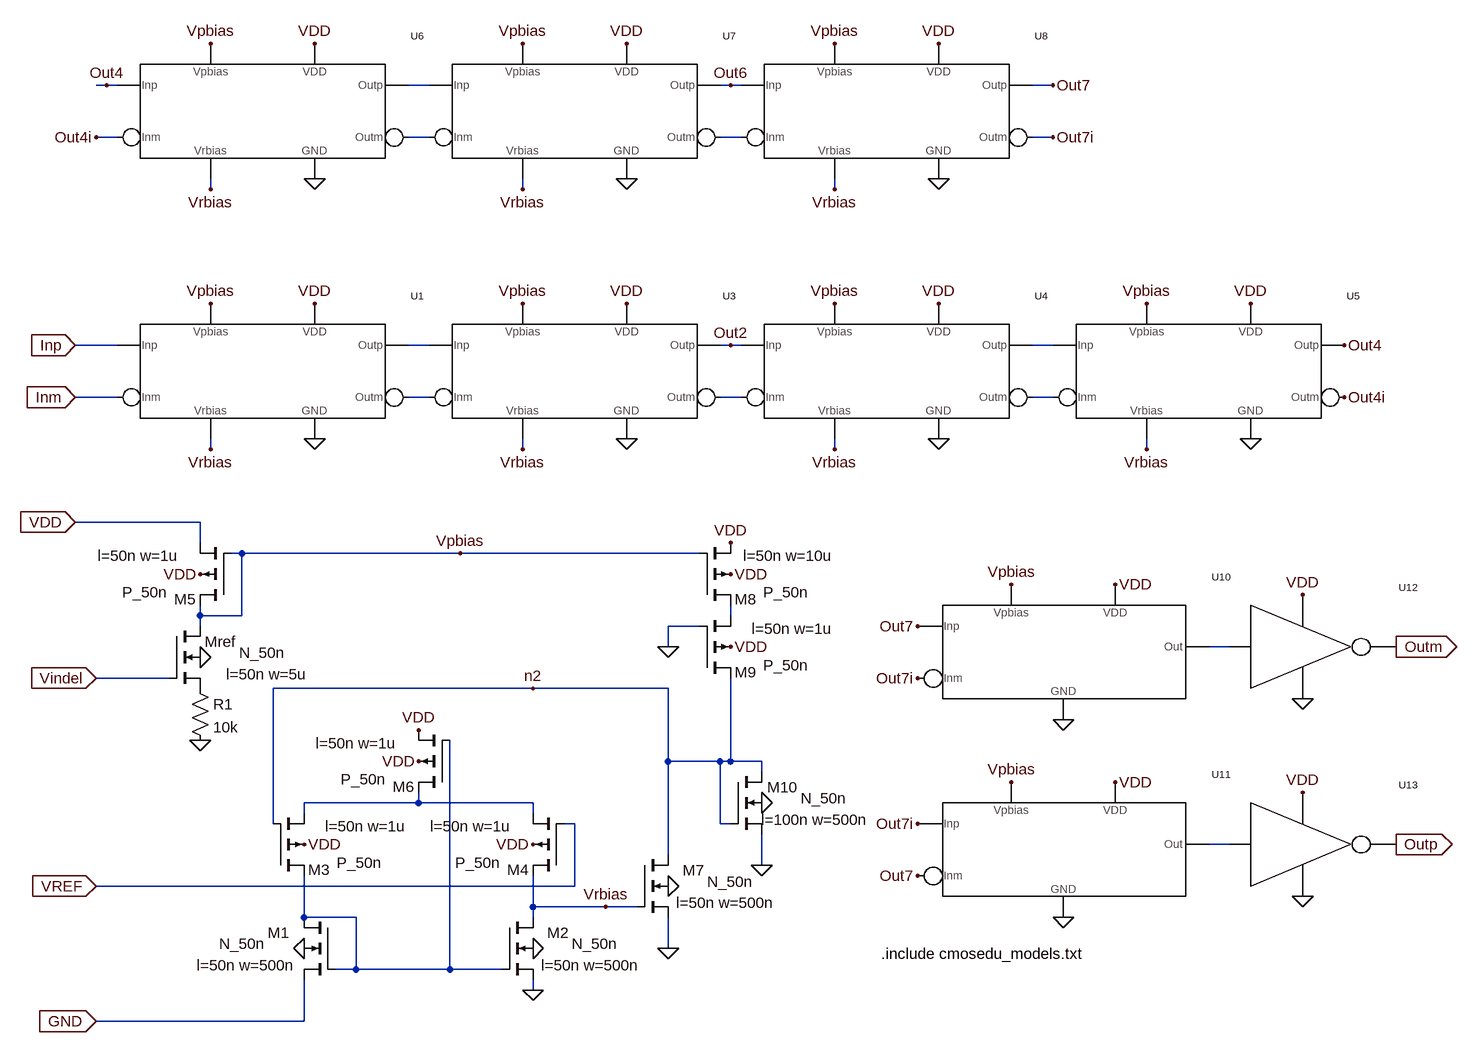
[diagram p0: schematic Fig_19_63.asc]
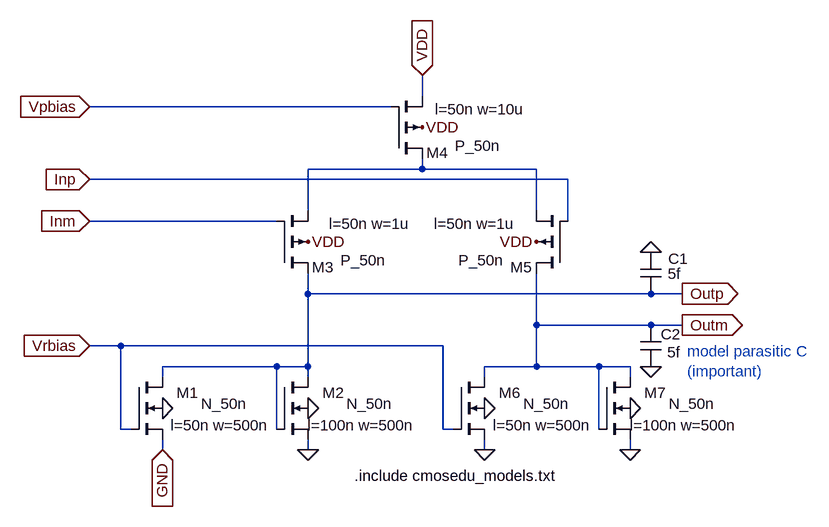
[diagram p1: sub-circuit delay.asc]
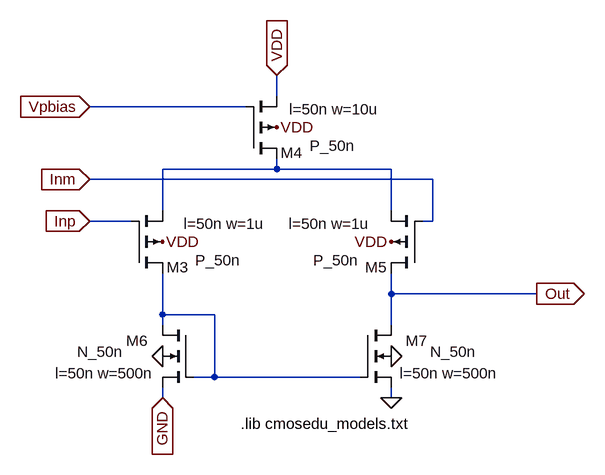
[diagram p2: sub-circuit pdiff.asc]
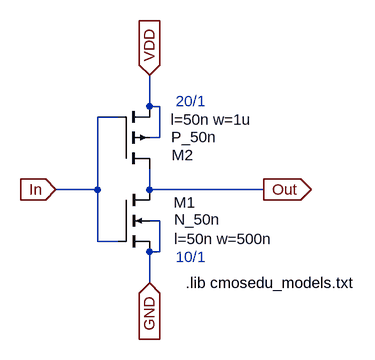
[diagram p3: sub-circuit inv_20_10.asc]
Fig_19_63.asc, the LTspice schematic file:
Version 4
SHEET 1 4588 680
WIRE 656 -1792 640 -1792
WIRE 672 -1792 656 -1792
WIRE 1152 -1792 1120 -1792
WIRE 1616 -1792 1600 -1792
WIRE 1632 -1792 1616 -1792
WIRE 2112 -1792 2080 -1792
WIRE 672 -1712 640 -1712
WIRE 1152 -1712 1120 -1712
WIRE 1632 -1712 1600 -1712
WIRE 2112 -1712 2080 -1712
WIRE 816 -1632 816 -1648
WIRE 1296 -1632 1296 -1648
WIRE 1776 -1632 1776 -1648
WIRE 672 -1392 608 -1392
WIRE 1152 -1392 1120 -1392
WIRE 1616 -1392 1600 -1392
WIRE 1632 -1392 1616 -1392
WIRE 2112 -1392 2080 -1392
WIRE 672 -1312 608 -1312
WIRE 1152 -1312 1120 -1312
WIRE 1632 -1312 1600 -1312
WIRE 2112 -1312 2080 -1312
WIRE 816 -1232 816 -1248
WIRE 1296 -1232 1296 -1248
WIRE 1776 -1232 1776 -1248
WIRE 2256 -1232 2256 -1248
WIRE 800 -1120 608 -1120
WIRE 800 -1088 800 -1120
WIRE 864 -1072 848 -1072
WIRE 1200 -1072 864 -1072
WIRE 1568 -1072 1200 -1072
WIRE 800 -976 800 -992
WIRE 864 -976 864 -1072
WIRE 864 -976 800 -976
WIRE 1616 -976 1616 -992
WIRE 800 -960 800 -976
WIRE 1568 -960 1520 -960
WIRE 1520 -928 1520 -960
WIRE 2384 -928 2352 -928
WIRE 752 -880 640 -880
WIRE 1312 -864 912 -864
WIRE 1520 -864 1312 -864
WIRE 1520 -752 1520 -864
WIRE 1600 -752 1520 -752
WIRE 1616 -752 1616 -880
WIRE 1616 -752 1600 -752
WIRE 1664 -752 1616 -752
WIRE 1664 -736 1664 -752
WIRE 1136 -688 1136 -704
WIRE 1136 -688 960 -688
WIRE 1312 -688 1136 -688
WIRE 960 -672 960 -688
WIRE 1312 -672 1312 -688
WIRE 912 -656 912 -864
WIRE 1376 -656 1360 -656
WIRE 1600 -656 1600 -752
WIRE 1616 -656 1600 -656
WIRE 2384 -624 2352 -624
WIRE 1520 -608 1520 -752
WIRE 1664 -592 1664 -640
WIRE 1376 -560 1376 -656
WIRE 1376 -560 640 -560
WIRE 1312 -528 1312 -576
WIRE 1424 -528 1312 -528
WIRE 1472 -528 1424 -528
WIRE 960 -512 960 -576
WIRE 1040 -512 960 -512
WIRE 1312 -512 1312 -528
WIRE 1520 -464 1520 -512
WIRE 1040 -432 1040 -512
WIRE 1040 -432 1008 -432
WIRE 1184 -432 1184 -784
WIRE 1184 -432 1040 -432
WIRE 1264 -432 1184 -432
WIRE 1312 -400 1312 -416
WIRE 960 -352 960 -416
WIRE 960 -352 640 -352
FLAG 960 -464 0
FLAG 960 -624 VDD
FLAG 1312 -624 VDD
FLAG 1312 -464 0
FLAG 800 -1040 VDD
FLAG 1520 -560 0
FLAG 1520 -464 0
FLAG 1136 -752 VDD
FLAG 1136 -800 VDD
FLAG 1312 -400 0
FLAG 800 -912 0
FLAG 800 -784 0
FLAG 1616 -1040 VDD
FLAG 1616 -1088 VDD
FLAG 1616 -928 VDD
FLAG 1520 -928 0
FLAG 1664 -688 0
FLAG 1664 -592 0
FLAG 1424 -528 Vrbias
FLAG 1312 -864 n2
FLAG 1200 -1072 Vpbias
FLAG 976 -1456 VDD
FLAG 976 -1248 0
FLAG 816 -1456 Vpbias
FLAG 816 -1232 Vrbias
FLAG 1456 -1456 VDD
FLAG 1456 -1248 0
FLAG 1296 -1456 Vpbias
FLAG 1296 -1232 Vrbias
FLAG 1936 -1456 VDD
FLAG 1936 -1248 0
FLAG 1776 -1456 Vpbias
FLAG 1776 -1232 Vrbias
FLAG 2416 -1456 VDD
FLAG 2416 -1248 0
FLAG 2256 -1456 Vpbias
FLAG 2256 -1232 Vrbias
FLAG 976 -1856 VDD
FLAG 976 -1648 0
FLAG 816 -1856 Vpbias
FLAG 816 -1632 Vrbias
FLAG 1456 -1856 VDD
FLAG 1456 -1648 0
FLAG 1296 -1856 Vpbias
FLAG 1296 -1632 Vrbias
FLAG 1936 -1856 VDD
FLAG 1936 -1648 0
FLAG 1776 -1856 Vpbias
FLAG 1776 -1632 Vrbias
FLAG 1616 -1392 Out2
FLAG 656 -1792 Out4
FLAG 1616 -1792 Out6
FLAG 2560 -1392 Out4
FLAG 2560 -1312 Out4i
FLAG 640 -1712 Out4i
FLAG 2128 -816 0
FLAG 2128 -512 0
FLAG 2208 -1024 VDD
FLAG 2208 -720 VDD
FLAG 1904 -960 Out7
FLAG 1904 -576 Out7
FLAG 1904 -880 Out7i
FLAG 1904 -656 Out7i
FLAG 2048 -1024 Vpbias
FLAG 2048 -720 Vpbias
FLAG 2496 -848 0
FLAG 2496 -544 0
FLAG 2496 -1008 VDD
FLAG 2496 -704 VDD
FLAG 2640 -928 Outm
IOPIN 2640 -928 Out
FLAG 2640 -624 Outp
IOPIN 2640 -624 Out
FLAG 640 -880 Vindel
IOPIN 640 -880 In
FLAG 640 -560 VREF
IOPIN 640 -560 In
FLAG 608 -1392 Inp
IOPIN 608 -1392 In
FLAG 608 -1312 Inm
IOPIN 608 -1312 In
FLAG 608 -1120 VDD
IOPIN 608 -1120 In
FLAG 640 -352 GND
IOPIN 640 -352 In
FLAG 2112 -1792 Out7
FLAG 2112 -1712 Out7i
SYMBOL nmos4 1008 -512 M0
WINDOW 0 104 24 Right 2
WINDOW 3 179 41 Right 2
WINDOW 123 213 74 Right 2
SYMATTR InstName M1
SYMATTR Value N_50n
SYMATTR Value2 l=50n w=500n
SYMBOL pmos4 912 -576 M180
WINDOW 0 88 9 Right 2
WINDOW 3 168 20 Right 2
WINDOW 123 206 76 Right 2
SYMATTR InstName M3
SYMATTR Value P_50n
SYMATTR Value2 l=50n w=1u
SYMBOL pmos4 1360 -576 R180
WINDOW 0 88 9 Right 2
WINDOW 3 168 20 Right 2
WINDOW 123 206 76 Right 2
SYMATTR InstName M4
SYMATTR Value P_50n
SYMATTR Value2 l=50n w=1u
SYMBOL nmos4 1264 -512 R0
WINDOW 0 104 24 Right 2
WINDOW 3 179 41 Right 2
WINDOW 123 213 74 Right 2
SYMATTR InstName M2
SYMATTR Value N_50n
SYMATTR Value2 l=50n w=500n
SYMBOL pmos4 848 -992 R180
WINDOW 0 88 9 Right 2
WINDOW 3 168 20 Right 2
WINDOW 123 206 76 Right 2
SYMATTR InstName M5
SYMATTR Value P_50n
SYMATTR Value2 l=50n w=1u
SYMBOL nmos4 1472 -608 R0
WINDOW 0 104 24 Right 2
WINDOW 3 179 41 Right 2
WINDOW 123 213 74 Right 2
SYMATTR InstName M7
SYMATTR Value N_50n
SYMATTR Value2 l=50n w=500n
SYMBOL pmos4 1184 -704 R180
WINDOW 0 88 9 Right 2
WINDOW 3 168 20 Right 2
WINDOW 123 206 76 Right 2
SYMATTR InstName M6
SYMATTR Value P_50n
SYMATTR Value2 l=50n w=1u
SYMBOL nmos4 752 -960 R0
WINDOW 0 104 24 Right 2
WINDOW 3 179 41 Right 2
WINDOW 123 213 74 Right 2
SYMATTR InstName Mref
SYMATTR Value N_50n
SYMATTR Value2 l=50n w=5u
SYMBOL res 784 -880 R0
SYMATTR InstName R1
SYMATTR Value 10k
SYMBOL pmos4 1568 -992 M180
WINDOW 0 88 9 Right 2
WINDOW 3 168 20 Right 2
WINDOW 123 206 76 Right 2
SYMATTR InstName M8
SYMATTR Value P_50n
SYMATTR Value2 l=50n w=10u
SYMBOL pmos4 1568 -880 M180
WINDOW 0 88 9 Right 2
WINDOW 3 168 20 Right 2
WINDOW 123 206 76 Right 2
SYMATTR InstName M9
SYMATTR Value P_50n
SYMATTR Value2 l=50n w=1u
SYMBOL nmos4 1616 -736 R0
WINDOW 0 104 24 Right 2
WINDOW 3 179 41 Right 2
WINDOW 123 213 74 Right 2
SYMATTR InstName M10
SYMATTR Value N_50n
SYMATTR Value2 l=100n w=500n
SYMBOL delay 704 -1344 R0
SYMATTR InstName U1
SYMBOL delay 1184 -1344 R0
SYMATTR InstName U3
SYMBOL delay 1664 -1344 R0
SYMATTR InstName U4
SYMBOL delay 2144 -1344 R0
SYMATTR InstName U5
SYMBOL delay 704 -1744 R0
SYMATTR InstName U6
SYMBOL delay 1184 -1744 R0
SYMATTR InstName U7
SYMBOL delay 1664 -1744 R0
SYMATTR InstName U8
SYMBOL pdiff 1936 -912 R0
SYMATTR InstName U10
SYMBOL pdiff 1936 -608 R0
SYMATTR InstName U11
SYMBOL INV_20_10 2416 -992 R0
SYMATTR InstName U12
SYMBOL INV_20_10 2416 -688 R0
SYMATTR InstName U13
TEXT 1848 -456 Left 2 !.include cmosedu_models.txt

delay.asc, the sub-circuit schematic file:
Version 4
SHEET 1 6288 680
WIRE 656 -608 656 -640
WIRE 608 -592 144 -592
WIRE 656 -496 656 -512
WIRE 656 -496 480 -496
WIRE 832 -496 656 -496
WIRE 880 -480 144 -480
WIRE 480 -432 480 -496
WIRE 832 -432 832 -496
WIRE 432 -416 144 -416
WIRE 880 -416 880 -480
WIRE 480 -304 480 -336
WIRE 1008 -304 480 -304
WIRE 1056 -304 1008 -304
WIRE 832 -256 832 -336
WIRE 1008 -256 832 -256
WIRE 1056 -256 1008 -256
WIRE 192 -224 144 -224
WIRE 688 -224 192 -224
WIRE 432 -192 256 -192
WIRE 480 -192 480 -304
WIRE 480 -192 432 -192
WIRE 832 -192 832 -256
WIRE 832 -192 752 -192
WIRE 928 -192 832 -192
WIRE 976 -192 928 -192
WIRE 256 -176 256 -192
WIRE 480 -176 480 -192
WIRE 752 -176 752 -192
WIRE 976 -176 976 -192
WIRE 192 -96 192 -224
WIRE 208 -96 192 -96
WIRE 432 -96 432 -192
WIRE 688 -96 688 -224
WIRE 704 -96 688 -96
WIRE 928 -96 928 -192
WIRE 256 -64 256 -80
WIRE 480 -64 480 -80
WIRE 752 -64 752 -80
WIRE 976 -64 976 -80
FLAG 256 -128 0
FLAG 656 -560 VDD
FLAG 480 -384 VDD
FLAG 480 -128 0
FLAG 144 -592 Vpbias
IOPIN 144 -592 In
FLAG 656 -640 VDD
IOPIN 656 -640 In
FLAG 832 -384 VDD
FLAG 144 -416 Inm
IOPIN 144 -416 In
FLAG 144 -480 Inp
IOPIN 144 -480 In
FLAG 480 -64 0
FLAG 752 -128 0
FLAG 976 -128 0
FLAG 976 -64 0
FLAG 752 -64 0
FLAG 144 -224 Vrbias
IOPIN 144 -224 In
FLAG 1056 -304 Outp
IOPIN 1056 -304 Out
FLAG 1056 -256 Outm
IOPIN 1056 -256 Out
FLAG 256 -64 GND
IOPIN 256 -64 In
FLAG 1008 -192 0
FLAG 1008 -368 0
SYMBOL nmos4 208 -176 R0
WINDOW 0 104 24 Right 0
WINDOW 3 179 41 Right 0
WINDOW 123 213 74 Right 0
SYMATTR InstName M1
SYMATTR Value N_50n
SYMATTR Value2 l=50n w=500n
SYMBOL pmos4 608 -512 M180
WINDOW 0 88 9 Right 0
WINDOW 3 168 20 Right 0
WINDOW 123 206 76 Right 0
SYMATTR InstName M4
SYMATTR Value P_50n
SYMATTR Value2 l=50n w=10u
SYMBOL pmos4 432 -336 M180
WINDOW 0 88 9 Right 0
WINDOW 3 168 20 Right 0
WINDOW 123 206 76 Right 0
SYMATTR InstName M3
SYMATTR Value P_50n
SYMATTR Value2 l=50n w=1u
SYMBOL nmos4 432 -176 R0
WINDOW 0 104 24 Right 0
WINDOW 3 179 41 Right 0
WINDOW 123 213 74 Right 0
SYMATTR InstName M2
SYMATTR Value N_50n
SYMATTR Value2 l=100n w=500n
SYMBOL pmos4 880 -336 R180
WINDOW 0 88 9 Right 0
WINDOW 3 168 20 Right 0
WINDOW 123 206 76 Right 0
SYMATTR InstName M5
SYMATTR Value P_50n
SYMATTR Value2 l=50n w=1u
SYMBOL nmos4 704 -176 R0
WINDOW 0 104 24 Right 0
WINDOW 3 179 41 Right 0
WINDOW 123 213 74 Right 0
SYMATTR InstName M6
SYMATTR Value N_50n
SYMATTR Value2 l=50n w=500n
SYMBOL nmos4 928 -176 R0
WINDOW 0 104 24 Right 0
WINDOW 3 179 41 Right 0
WINDOW 123 213 74 Right 0
SYMATTR InstName M7
SYMATTR Value N_50n
SYMATTR Value2 l=100n w=500n
SYMBOL cap 992 -368 R0
WINDOW 0 43 10 Left 0
WINDOW 3 42 33 Left 0
SYMATTR InstName C1
SYMATTR Value 5f
SYMBOL cap 992 -256 R0
WINDOW 0 31 14 Left 0
WINDOW 3 41 42 Left 0
SYMATTR InstName C2
SYMATTR Value 5f
TEXT 552 -24 Left 0 !.include cmosedu_models.txt
TEXT 1064 -216 Left 0 ;model parasitic C\n(important)

pdiff.asc, the sub-circuit schematic file:
Version 4
SHEET 1 6288 680
WIRE 432 -416 368 -416
WIRE 480 -432 480 -496
WIRE 480 -272 480 -336
WIRE 480 -256 480 -272
WIRE 480 -144 480 -160
WIRE 560 -272 480 -272
WIRE 560 -176 528 -176
WIRE 560 -176 560 -272
WIRE 608 -592 368 -592
WIRE 656 -608 656 -640
WIRE 656 -496 480 -496
WIRE 656 -496 656 -512
WIRE 784 -176 560 -176
WIRE 832 -496 656 -496
WIRE 832 -432 832 -496
WIRE 832 -304 832 -336
WIRE 832 -256 832 -304
WIRE 832 -144 832 -160
WIRE 896 -480 368 -480
WIRE 896 -416 880 -416
WIRE 896 -416 896 -480
WIRE 1056 -304 832 -304
FLAG 656 -560 VDD
FLAG 480 -384 VDD
FLAG 368 -592 Vpbias
IOPIN 368 -592 In
FLAG 656 -640 VDD
IOPIN 656 -640 In
FLAG 832 -384 VDD
FLAG 368 -416 Inp
IOPIN 368 -416 In
FLAG 368 -480 Inm
IOPIN 368 -480 In
FLAG 480 -208 0
FLAG 832 -208 0
FLAG 832 -144 0
FLAG 1056 -304 Out
IOPIN 1056 -304 Out
FLAG 480 -144 GND
IOPIN 480 -144 In
SYMBOL pmos4 608 -512 M180
WINDOW 0 88 9 Right 0
WINDOW 3 168 20 Right 0
WINDOW 123 206 76 Right 0
SYMATTR InstName M4
SYMATTR Value P_50n
SYMATTR Value2 l=50n w=10u
SYMBOL pmos4 432 -336 M180
WINDOW 0 88 9 Right 0
WINDOW 3 168 20 Right 0
WINDOW 123 206 76 Right 0
SYMATTR InstName M3
SYMATTR Value P_50n
SYMATTR Value2 l=50n w=1u
SYMBOL pmos4 880 -336 R180
WINDOW 0 88 9 Right 0
WINDOW 3 168 20 Right 0
WINDOW 123 206 76 Right 0
SYMATTR InstName M5
SYMATTR Value P_50n
SYMATTR Value2 l=50n w=1u
SYMBOL nmos4 528 -256 M0
WINDOW 0 104 24 Right 0
WINDOW 3 179 41 Right 0
WINDOW 123 213 74 Right 0
SYMATTR InstName M6
SYMATTR Value N_50n
SYMATTR Value2 l=50n w=500n
SYMBOL nmos4 784 -256 R0
WINDOW 0 104 24 Right 0
WINDOW 3 179 41 Right 0
WINDOW 123 213 74 Right 0
SYMATTR InstName M7
SYMATTR Value N_50n
SYMATTR Value2 l=50n w=500n
TEXT 600 -104 Left 0 !.lib cmosedu_models.txt

inv_20_10.asc, the sub-circuit schematic file:
Version 4
SHEET 1 1136 680
WIRE 448 -304 448 -352
WIRE 464 -304 448 -304
WIRE 400 -288 368 -288
WIRE 464 -256 464 -304
WIRE 464 -256 448 -256
WIRE 368 -176 368 -288
WIRE 368 -176 304 -176
WIRE 448 -176 448 -208
WIRE 624 -176 448 -176
WIRE 464 -128 448 -128
WIRE 368 -96 368 -176
WIRE 400 -96 368 -96
WIRE 464 -80 464 -128
WIRE 464 -80 448 -80
WIRE 448 -32 448 -80
FLAG 304 -176 In
IOPIN 304 -176 In
FLAG 448 -352 VDD
IOPIN 448 -352 In
FLAG 448 -32 GND
IOPIN 448 -32 In
FLAG 624 -176 Out
IOPIN 624 -176 Out
SYMBOL nmos4 400 -176 R0
WINDOW 0 119 20 Right 2
WINDOW 3 157 46 Right 2
WINDOW 123 238 76 Right 2
SYMATTR InstName M1
SYMATTR Value N_50n
SYMATTR Value2 l=50n w=500n
SYMBOL pmos4 400 -208 M180
WINDOW 0 116 21 Right 2
WINDOW 3 151 49 Right 2
WINDOW 123 206 76 Right 2
SYMATTR InstName M2
SYMATTR Value P_50n
SYMATTR Value2 l=50n w=1u
TEXT 488 -312 Left 2 ;20/1
TEXT 488 -72 Left 2 ;10/1
TEXT 504 -32 Left 2 !.lib cmosedu_models.txt

The netlist it stands for:
* Fig_19_63.asc
M1 N013 N013 GND 0 N_50n l=50n w=500n
M3 N013 n2 N011 VDD P_50n l=50n w=1u
M4 Vrbias VREF N011 VDD P_50n l=50n w=1u
M2 Vrbias N013 0 0 N_50n l=50n w=500n
M5 Vpbias Vpbias VDD VDD P_50n l=50n w=1u
M7 n2 Vrbias 0 0 N_50n l=50n w=500n
M6 N011 N013 VDD VDD P_50n l=50n w=1u
Mref Vpbias Vindel P001 0 N_50n l=50n w=5u
R1 P001 0 10k
M8 N009 Vpbias VDD VDD P_50n l=50n w=10u
M9 n2 0 N009 VDD P_50n l=50n w=1u
M10 n2 n2 0 0 N_50n l=100n w=500n
XU1 Inp Inm N004 N006 Vpbias Vrbias VDD 0 delay
XU3 N004 N006 Out2 N007 Vpbias Vrbias VDD 0 delay
XU4 Out2 N007 N005 N008 Vpbias Vrbias VDD 0 delay
XU5 N005 N008 Out4 Out4i Vpbias Vrbias VDD 0 delay
XU6 Out4 Out4i N001 N002 Vpbias Vrbias VDD 0 delay
XU7 N001 N002 Out6 N003 Vpbias Vrbias VDD 0 delay
XU8 Out6 N003 Out7 Out7i Vpbias Vrbias VDD 0 delay
XU10 Out7 Out7i N010 Vpbias VDD 0 pdiff
XU11 Out7i Out7 N012 Vpbias VDD 0 pdiff
XU12 N010 Outm VDD 0 inv_20_10
XU13 N012 Outp VDD 0 inv_20_10

* block symbol definitions
.subckt delay Inp Inm Outp Outm Vpbias Vrbias VDD GND
M1 Outp Vrbias GND 0 N_50n l=50n w=500n
M4 N001 Vpbias VDD VDD P_50n l=50n w=10u
M3 Outp Inm N001 VDD P_50n l=50n w=1u
M2 Outp Outp 0 0 N_50n l=100n w=500n
M5 Outm Inp N001 VDD P_50n l=50n w=1u
M6 Outm Vrbias 0 0 N_50n l=50n w=500n
M7 Outm Outm 0 0 N_50n l=100n w=500n
C1 0 Outp 5f
C2 Outm 0 5f
.include cmosedu_models.txt
* model parasitic C
* (important)
.ends delay

.subckt pdiff Inp Inm Out Vpbias VDD GND
M4 N001 Vpbias VDD VDD P_50n l=50n w=10u
M3 N002 Inp N001 VDD P_50n l=50n w=1u
M5 Out Inm N001 VDD P_50n l=50n w=1u
M6 N002 N002 GND 0 N_50n l=50n w=500n
M7 Out N002 0 0 N_50n l=50n w=500n
.lib cmosedu_models.txt
.ends pdiff

.subckt inv_20_10 In Out VDD GND
M1 Out In GND GND N_50n l=50n w=500n
M2 Out In VDD VDD P_50n l=50n w=1u
* 20/1
* 10/1
.lib cmosedu_models.txt
.ends inv_20_10

.model NMOS NMOS
.model PMOS PMOS
.lib standard.mos
.include cmosedu_models.txt
.backanno
.end